# EAGLE design arduino seringa (EAGLE 8.4.0)
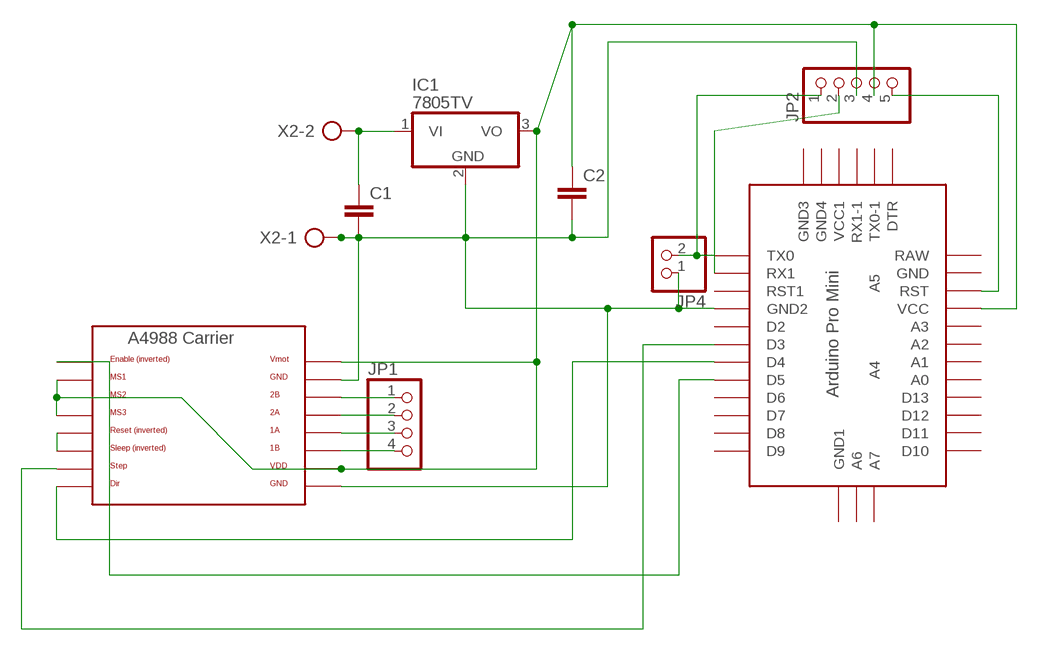
[diagram p0: schematic, sheet 1]

## Parts
C1  C5/3  [C5B3]
C2  C5/3  [C5B3]
IC1  7805TV  [TO220V]
JP1  PINHD-1X4  [1X04]
JP2  PINHD-1X5  [1X05]
JP4  PINHD-1X2  [1X02]
U$1  ABK-PRO-MINI  [ABK-PRO-MINI]
U$2  A4988BREAKOUT  [A4988BREAKOUT]
X2  AK500/2  [AK500/2]

## Nets
N$1: JP2.1 JP4.2 U$1.TX0
N$2: C1.2 C2.2 IC1.2(GND) JP2.3 JP4.1 U$1.GND1(GND2) U$2.GND U$2.GND@0(GND) X2.1
N$3: C1.1 IC1.1(VI) X2.2
N$4: JP2.5 U$1.RST
N$5: JP2.2 U$1.RX1
N$12: JP1.1 U$2.2B
N$13: JP1.2 U$2.2A
N$14: JP1.3 U$2.1A
N$15: JP1.4 U$2.1B
N$16: U$1.D5 U$2.EN
N$17: C2.1 IC1.3(VO) JP2.4 U$1.VCC U$2.MS1 U$2.MS2 U$2.MS3 U$2.VDD U$2.VMOT
N$18: U$2.RST U$2.SLP(SLEEP)
N$19: U$1.D3 U$2.STEP
N$20: U$1.D4 U$2.DIR
Unconnected: U$1.A0 U$1.A1 U$1.A2 U$1.A3 U$1.A4 U$1.A5 U$1.A6 U$1.A7 U$1.D2 U$1.D6 U$1.D7 U$1.D8 U$1.D9 U$1.D10 U$1.D11 U$1.D12 U$1.D13 U$1.DTR U$1.GND U$1.GND2(GND3) U$1.GND3(GND4) U$1.GND4(GND1) U$1.RAW U$1.RST1 U$1.RX1-1 U$1.TX0-1 U$1.VCC1

## Library data of the parts
C1 C2 = capacitor-wima:C: CAPACITOR naming: grid - package width
IC1 = linear:78*: Positive VOLTAGE REGULATOR Source: http://cache.national.com/ds/LM/LM78L05.pdf http://www.fairchildsemi.com/ds/LM/LM7805.pdf
JP1 = pinhead:PINHD-1X4: PIN HEADER
JP2 = pinhead:PINHD-1X5: PIN HEADER
JP4 = pinhead:PINHD-1X2: PIN HEADER
U$1 = Arduino-clone:ABK-PRO-MINI: ABK Pro-Mini Arduino Clone
U$2 = RepRapjr:A4988BREAKOUT
X2 = con-ptr500:AK500/2: CONNECTOR; OC_FARNELL: unknown; OC_NEWARK: unknown

## Board
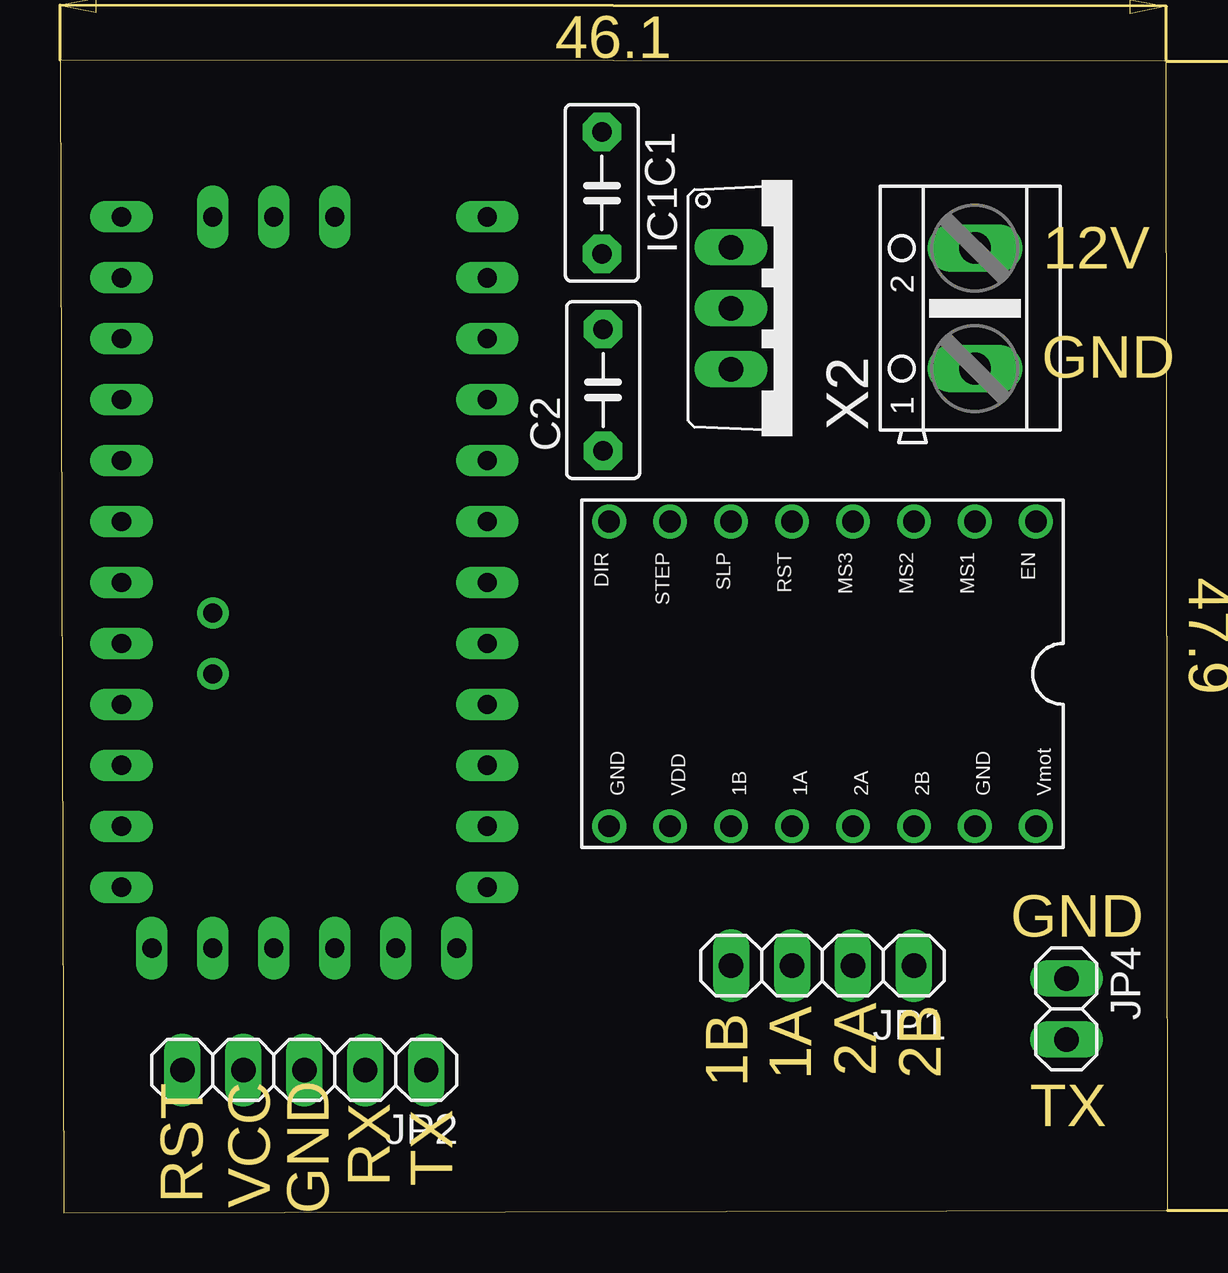
[diagram p1: board, top side]
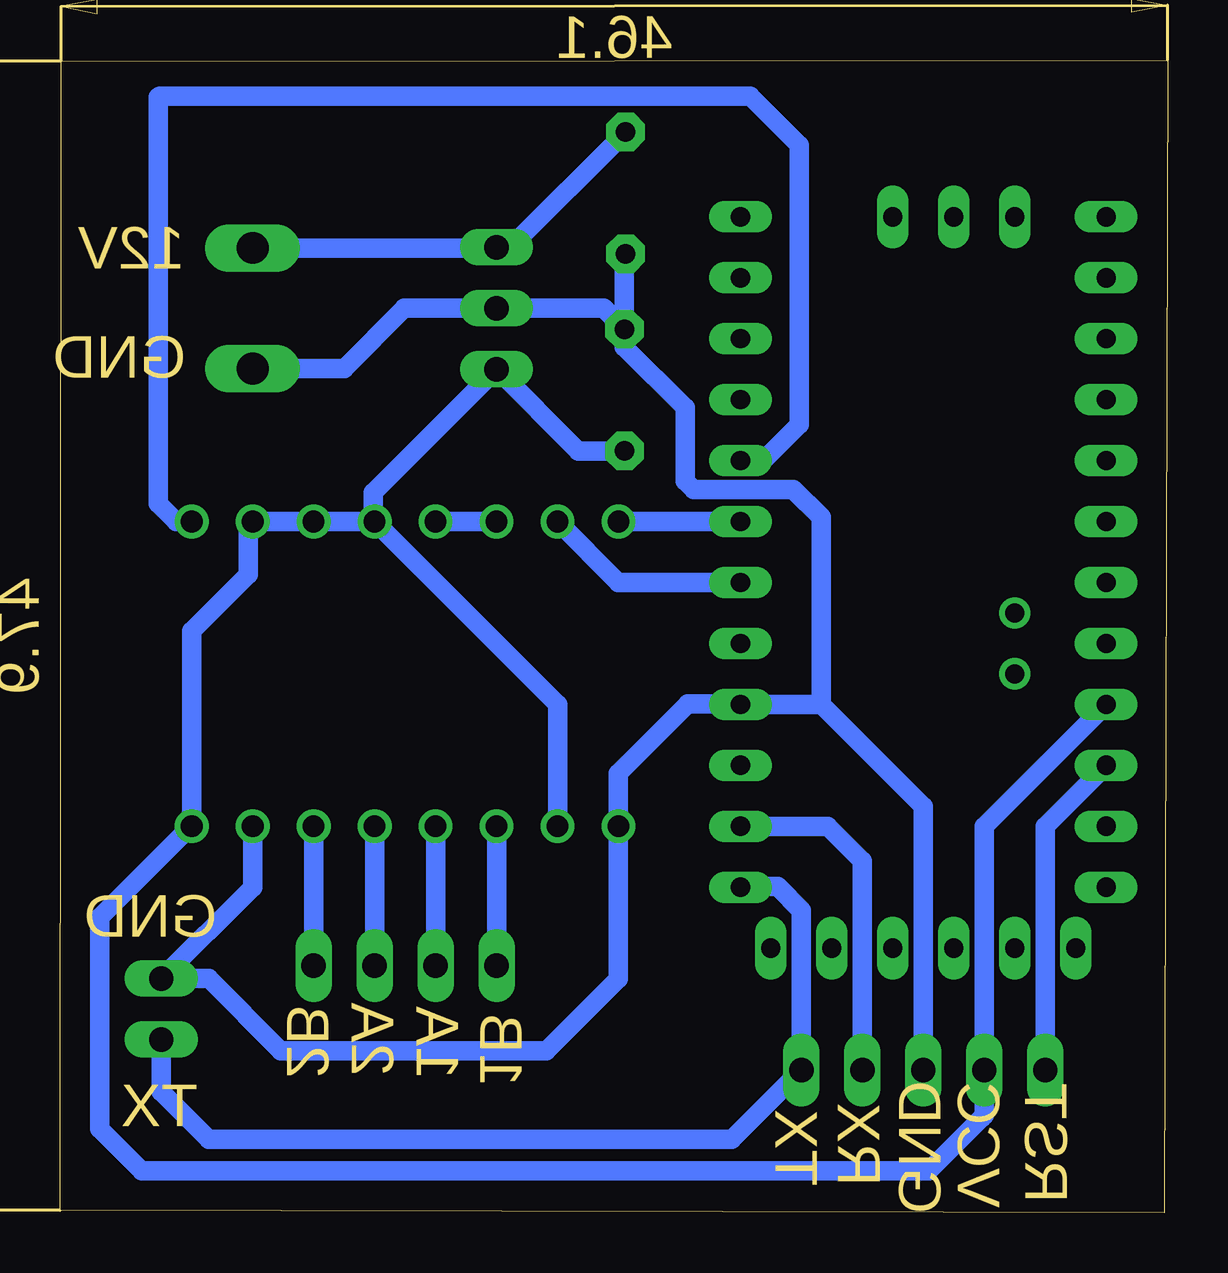
[diagram p2: board, bottom side, seen from below]

Size 46.15 x 48.05 mm. Coordinates in mm from the lower left corner, seen from the top.
Outline: 0.15,0 46.15,0.1 46.1,48 0,48.05 0.15,0
Copper layers (1*16): Top 0.035mm / dielectric 1.5mm / Bottom 0.035mm
Design rules "default": minimum track width 6mil, minimum drill 0.35mm, track to track 6mil, track to pad 6mil, pad to pad 6mil, via to via 6mil, smd to smd 6mil, copper to edge 40mil, drill to drill 6mil, minimum pad ring 10mil, minimum via ring 8mil, stop-mask expansion 4mil, vias tented up to drill 0mil, thermal gap 10mil
Milling: area 44.6,50 to 46.1,50.6; area 0,50 to 1.5,50.6; area 20.3,48.1 to 25.8,49.9; area 48.9,0.1 to 49.5,1.6; area 48.9,46.5 to 49.5,48; area 47,21.3 to 48.8,26.8; 6 lines

### Footprints (pad centres in the part's own frame; a part is rotated, then mirrored left to right if it is on the bottom)
C5B3 = drill 0.813 pad 1.6 octagon: 1 -2.54,0; 2 2.54,0
TO220V = drill 1.016 long: 1 -2.54,-2.54; 2 0,-2.54; 3 2.54,-2.54
1X04 = drill 1.016 long: 1 -3.81,0; 2 -1.27,0; 3 1.27,0; 4 3.81,0
1X05 = drill 1.016 long: 1 -5.08,0; 2 -2.54,0; 3 0,0; 4 2.54,0; 5 5.08,0
1X02 = drill 1.016 long: 1 -1.27,0; 2 1.27,0
ABK-PRO-MINI = drill 0.8 long: A0 10.16,-3.81; A1 10.16,-6.35; A2 10.16,-8.89; A3 10.16,-11.43; A6 3.81,-21.59; A7 6.35,-21.59; D2 -5.08,-3.81; D3 -5.08,-6.35; D4 -5.08,-8.89; D5 -5.08,-11.43; D6 -5.08,-13.97; D7 -5.08,-16.51; D8 -5.08,-19.05; D9 -5.08,-21.59; D10 10.16,-21.59; D11 10.16,-19.05; D12 10.16,-16.51; D13 10.16,-13.97; DTR 8.89,8.89; GND 10.16,3.81; GND1 -5.08,-1.27; GND2 -3.81,8.89; GND3 -1.27,8.89; GND4 1.27,-21.59; RAW 10.16,6.35; RST 10.16,1.27; RST1 -5.08,1.27; RX1 -5.08,3.81; RX1-1 3.81,8.89; TX0 -5.08,6.35; TX0-1 6.35,8.89; VCC 10.16,-1.27; VCC1 1.27,8.89 | drill 0.8: A4 6.35,-5.08; A5 6.35,-2.54
A4988BREAKOUT = drill 0.9: 1A 8.89,1.27; 1B 11.43,1.27; 2A 6.35,1.27; 2B 3.81,1.27; DIR 16.51,-11.43; EN -1.27,-11.43; GND 16.51,1.27; GND@0 1.27,1.27; MS1 1.27,-11.43; MS2 3.81,-11.43; MS3 6.35,-11.43; RST 8.89,-11.43; SLP 11.43,-11.43; STEP 13.97,-11.43; VDD 13.97,1.27; VMOT -1.27,1.27
AK500/2 = drill 1.321 long: 1 -2.515,0; 2 2.515,0

### Placement (x,y rotation side)
C1  22.58,42.51 270 top
C2  22.63,34.29 90 top
IC1  30.5,37.7 270 top
JP1  31.77,10.3 180 top
JP2  10.18,5.95 180 top
JP4  41.93,8.49 270 top
U$1  12.72,19.92 180 top
U$2  39.39,17.38 180 top
X2  38.12,37.7 90 top

### Tracks (layer width: path | path; a pad name or v marks a point on that pad's centre or on a via)
N$1
  Bottom 0.813: U$1.TX0 17.77,13.6 16.25,13.6 15.26,12.61 JP2.1 18.16,3.05 39.95,3.05 41.93,5.03 JP4.2
N$2
  Bottom 0.813: JP2.3 10.18,16.93 14.44,21.19 | 14.44,21.19 U$1.GND1 20,21.2 22.88,18.32 U$2.GND 22.9,16.09 22.9,9.75 25.9,6.75 36.95,6.75 39.96,9.76 JP4.1 38.12,13.57 U$2.GND@0 | X2.1 34.32,35.19 31.8,37.7 IC1.2 23.5,37.7 C2.2 | C2.2 22.63,39.92 C1.2 | C2.2 22.63,36.08 20.1,33.55 20.1,30.5 19.74,30.14 16.64,30.14 16.63,30.15 15.6,30.15 14.44,28.99 14.44,21.19
N$3
  Bottom 0.813: X2.2 27.98,40.22 IC1.1 27.39,40.24 C1.1
N$4
  Bottom 0.813: JP2.5 5.1,16.11 U$1.RST
N$5
  Bottom 0.813: JP2.2 12.72,14.67 14.16,16.11 U$1.RX1
N$12
  Bottom 0.813: JP1.1 U$2.2B
N$13
  Bottom 0.813: JP1.2 U$2.2A
N$14
  Bottom 0.813: JP1.3 U$2.1A
N$15
  Bottom 0.813: JP1.4 U$2.1B
N$16
  Bottom 0.813: U$1.D5 16.95,31.35 16.9,31.3 15.35,32.85 15.35,44.5 17.4,46.55 42,46.55 42.05,46.5 42.05,29.55 41.31,28.81 U$2.EN
N$17
  Bottom 0.813: U$1.VCC 7.64,16.11 JP2.4 7.64,4.06 7.75,3.95 9.95,1.75 42.75,1.75 44.5,3.5 44.5,12.31 40.66,16.15 | 40.66,16.15 U$2.VMOT | 40.66,16.15 40.66,24.24 38.3,26.6 38.3,28.63 U$2.MS1 U$2.MS2 33.1,28.81 | 33.1,28.81 U$2.MS3 25.42,21.19 U$2.VDD | C2.1 24.55,31.75 IC1.3 33.1,30.02 33.1,28.81
N$18
  Bottom 0.813: U$2.RST U$2.SLP
N$19
  Bottom 0.813: U$1.D3 22.88,26.27 U$2.STEP
N$20
  Bottom 0.813: U$2.DIR U$1.D4

### Text on the board
Milling: 12V | GND | GND | 2A | 1B | 1A | 2B | TX | RX | TX | RST | VCC | GND